# Altium schematic sheet Sheet3.SchDoc
size A
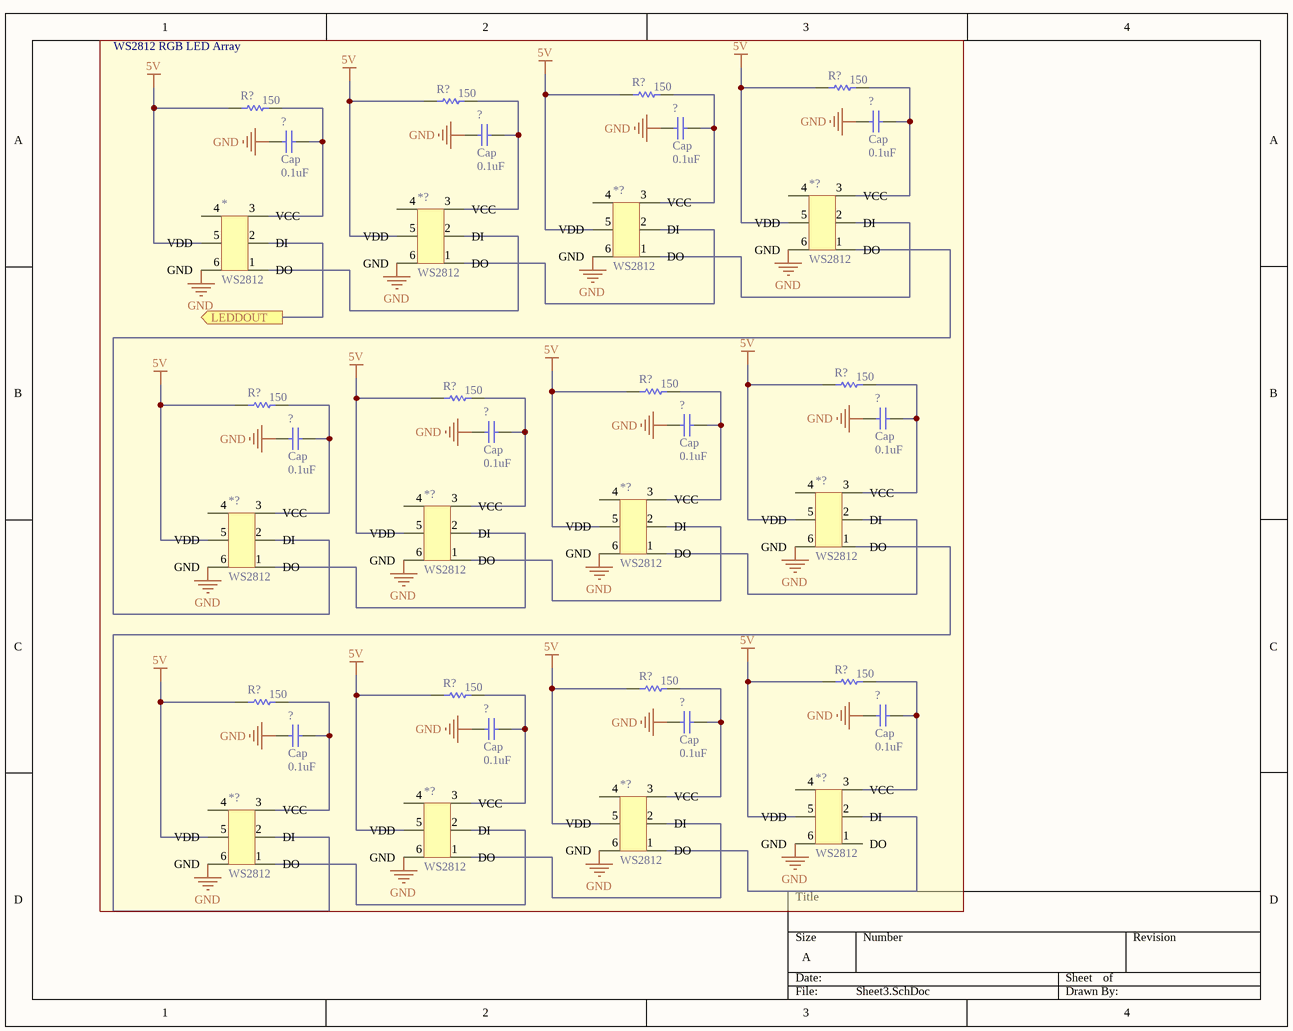
[diagram p0: Sheet3.SchDoc]

## Parts
(Parts that share a designator on the sheet are numbered #1, #2 ... from top to bottom, then left to right.)
*  WS2812
*?#1  WS2812
*?#2  WS2812
*?#3  WS2812
*?#4  WS2812
*?#5  WS2812
*?#6  WS2812
*?#7  WS2812
*?#8  WS2812
*?#9  WS2812
*?#10  WS2812
*?#11  WS2812
?#1  Cap  value 0.1uF  [RAD-0.3]
?#2  Cap  value 0.1uF  [RAD-0.3]
?#3  Cap  value 0.1uF  [RAD-0.3]
?#4  Cap  value 0.1uF  [RAD-0.3]
?#5  Cap  value 0.1uF  [RAD-0.3]
?#6  Cap  value 0.1uF  [RAD-0.3]
?#7  Cap  value 0.1uF  [RAD-0.3]
?#8  Cap  value 0.1uF  [RAD-0.3]
?#9  Cap  value 0.1uF  [RAD-0.3]
?#10  Cap  value 0.1uF  [RAD-0.3]
?#11  Cap  value 0.1uF  [RAD-0.3]
?#12  Cap  value 0.1uF  [RAD-0.3]
R?#1  value 150  [AXIAL-0.3]  (hidden comment: Res1)
R?#2  value 150  [AXIAL-0.3]  (hidden comment: Res1)
R?#3  value 150  [AXIAL-0.3]  (hidden comment: Res1)
R?#4  value 150  [AXIAL-0.3]  (hidden comment: Res1)
R?#5  value 150  [AXIAL-0.3]  (hidden comment: Res1)
R?#6  value 150  [AXIAL-0.3]  (hidden comment: Res1)
R?#7  value 150  [AXIAL-0.3]  (hidden comment: Res1)
R?#8  value 150  [AXIAL-0.3]  (hidden comment: Res1)
R?#9  value 150  [AXIAL-0.3]  (hidden comment: Res1)
R?#10  value 150  [AXIAL-0.3]  (hidden comment: Res1)
R?#11  value 150  [AXIAL-0.3]  (hidden comment: Res1)
R?#12  value 150  [AXIAL-0.3]  (hidden comment: Res1)

## Blocks framed on the sheet
WS2812 RGB LED Array: * *?#1-*?#11 ?#1-?#12 R?#1-R?#12

## Ports
LEDDOUT (out)

## Nets
5V: R?#1.2 R?#2.2 R?#3.2 R?#4.2 R?#5.2 R?#6.2 R?#7.2 R?#8.2 R?#9.2 R?#10.2 R?#11.2 R?#12.2
GND: ?#1.2 ?#2.2 ?#3.2 ?#4.2 ?#5.2 ?#6.2 ?#7.2 ?#8.2 ?#9.2 ?#10.2 ?#11.2 ?#12.2
Net?#1_1: ?#1.1 R?#1.1
Net?#2_1: ?#2.1 R?#2.1
Net?#3_1: ?#3.1 R?#3.1
Net?#4_1: ?#4.1 R?#4.1
Net?#5_1: ?#5.1 R?#5.1
Net?#6_1: ?#6.1 R?#6.1
Net?#7_1: ?#7.1 R?#7.1
Net?#8_1: ?#8.1 R?#8.1
Net?#9_1: ?#9.1 R?#9.1
Net?#10_1: ?#10.1 R?#10.1
Net?#11_1: ?#11.1 R?#11.1
Net?#12_1: ?#12.1 R?#12.1

Not connected (* = marked no-connect by the designer): * 1(DO) 2(DI) 3(VCC) 4 5(VDD) 6(GND); *?#1 1(DO) 2(DI) 3(VCC) 4 5(VDD) 6(GND); *?#2 1(DO) 2(DI) 3(VCC) 4 5(VDD) 6(GND); *?#3 1(DO) 2(DI) 3(VCC) 4 5(VDD) 6(GND); *?#4 1(DO) 2(DI) 3(VCC) 4 5(VDD) 6(GND); *?#5 1(DO) 2(DI) 3(VCC) 4 5(VDD) 6(GND); *?#6 1(DO) 2(DI) 3(VCC) 4 5(VDD) 6(GND); *?#7 1(DO) 2(DI) 3(VCC) 4 5(VDD) 6(GND); *?#8 1(DO) 2(DI) 3(VCC) 4 5(VDD) 6(GND); *?#9 1(DO) 2(DI) 3(VCC) 4 5(VDD) 6(GND); *?#10 1(DO) 2(DI) 3(VCC) 4 5(VDD) 6(GND); *?#11 1(DO) 2(DI) 3(VCC) 4 5(VDD) 6(GND)

## Notes on the sheet
- Labels drawn without touching a wire or pin: GND

## Library data of the parts
* *?#1-*?#11 = WS2812: http://cdn.sparkfun.com/datasheets/Components/LED/WS2812.pdf; ComponentLink1Description: Digikey; ComponentLink1URL: https://www.digikey.ca/product-detail/en/sparkfun-electronics/COM-11821/1568-1800-ND/6163706; ComponentLink2Description: Datasheet; ComponentLink2URL: http://cdn.sparkfun.com/datasheets/Components/LED/WS2812.pdf
?#1-?#12 = Cap: Capacitor; Published: 8-Jun-2000; LatestRevisionDate: 17-Jul-2002; LatestRevisionNote: Re-released for DXP Platform.; PackageReference: RAD-0.3; Publisher: Altium Limited; PackageDescription: Radial Cap, Thru-Hole; 2 Leads; 0.3 in Pin Spacing
R?#1-R?#12 = Res1: Resistor; Published: 8-Jun-2000; LatestRevisionDate: 17-Jul-2002; LatestRevisionNote: Re-released for DXP Platform.; PackageReference: AXIAL-0.3; Publisher: Altium Limited; PackageDescription: Axial Device, Thru-Hole; 2 Leads; 0.3 in Pin Spacing